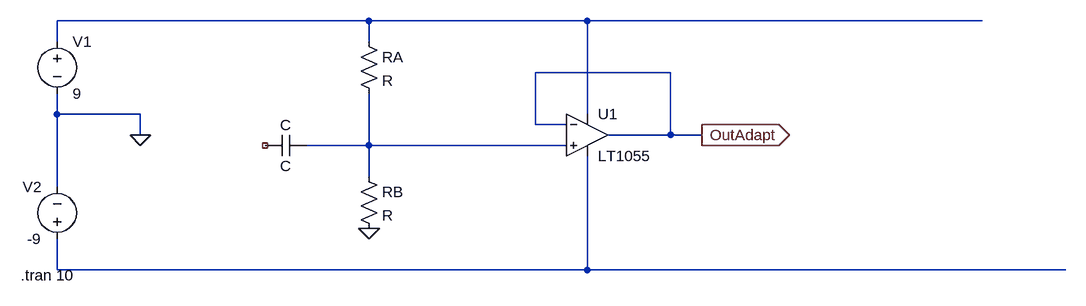
[diagram p0: schematic C2.asc]
C2.asc, the LTspice schematic file:
Version 4
SHEET 1 2020 680
WIRE 544 64 64 64
WIRE 880 64 544 64
WIRE 1488 64 880 64
WIRE 64 96 64 64
WIRE 544 96 544 64
WIRE 1008 144 800 144
WIRE 64 208 64 176
WIRE 192 208 64 208
WIRE 880 208 880 64
WIRE 800 224 800 144
WIRE 848 224 800 224
WIRE 192 240 192 208
WIRE 1008 240 1008 144
WIRE 1008 240 912 240
WIRE 1056 240 1008 240
WIRE 544 256 544 176
WIRE 544 256 448 256
WIRE 848 256 544 256
WIRE 544 304 544 256
WIRE 64 320 64 208
WIRE 64 448 64 400
WIRE 880 448 880 272
WIRE 880 448 64 448
WIRE 1616 448 880 448
FLAG 192 240 0
FLAG 544 384 0
FLAG 1056 240 OutAdapt
IOPIN 1056 240 Out
SYMBOL voltage 64 80 R0
WINDOW 123 0 0 Left 0
WINDOW 39 0 0 Left 0
SYMATTR InstName V1
SYMATTR Value 9
SYMBOL voltage 64 416 R180
WINDOW 0 24 96 Left 2
WINDOW 3 24 16 Left 2
WINDOW 123 0 0 Left 0
WINDOW 39 0 0 Left 0
SYMATTR InstName V2
SYMATTR Value -9
SYMBOL cap 448 240 R90
WINDOW 0 0 32 VBottom 2
WINDOW 3 32 32 VTop 2
SYMATTR InstName C
SYMBOL res 528 80 R0
SYMATTR InstName RA
SYMBOL res 528 288 R0
SYMATTR InstName RB
SYMBOL OpAmps\\LT1055 880 176 R0
SYMATTR InstName U1
TEXT 8 456 Left 2 !.tran 10

The netlist it stands for:
* C2.asc
V1 N001 0 9
V2 N003 0 -9
C N002 NC_01 C
RA N001 N002 R
RB N002 0 R
XU1 N002 OutAdapt N001 N003 OutAdapt LT1055  ; pins In+ In- V+ V- OUT
.tran 10
.backanno
.end